# Altium schematic sheet wisp-5-mcu.SchDoc
size A
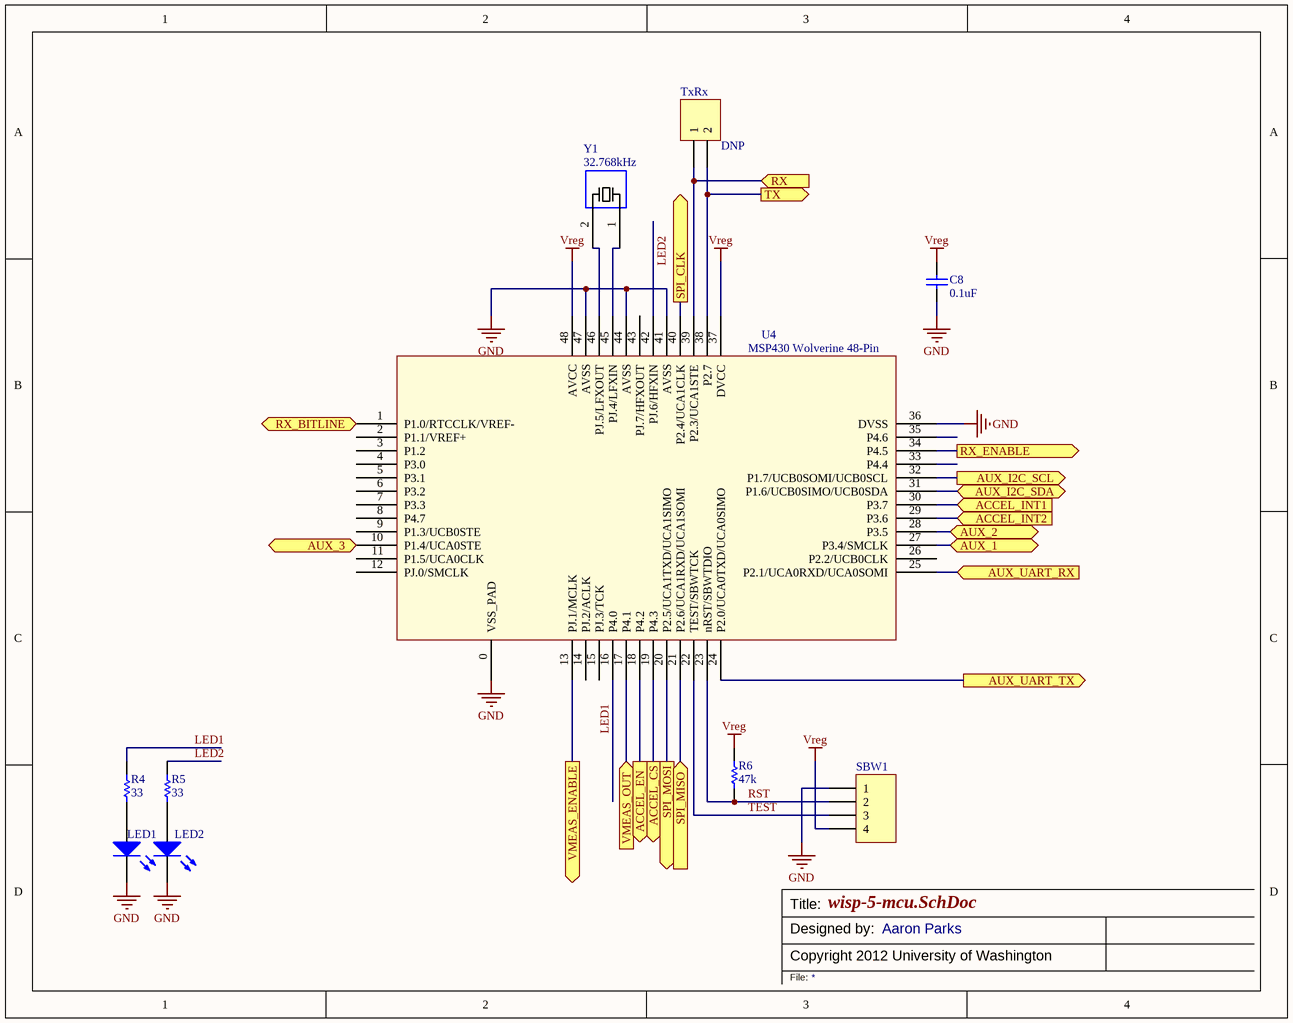
[diagram p0: wisp-5-mcu.SchDoc]

## Parts
C8  value 0.1uF  [0402]  (hidden comment: Cap)
LED1  LED  [Diode - 0603]  (value not drawn)
LED2  LED  [Diode - 0603]  (value not drawn)
R4  value 33  [0402]  (hidden comment: Res)
R5  value 33  [0402]  (hidden comment: Res)
R6  value 47k  [0402]  (hidden comment: Res)
SBW1  4-Pin 0.05" Pitch Female Rt Angle Header  [MHDR1X4]  (value not drawn)
TxRx  MHDR1X2  [MHDR1X2]  (value not drawn)
U4  MSP430 Wolverine 48-Pin  [MSP_QFN48_RGZ_PAD0]
Y1  value 32.768kHz  [XTAL [3.20mm x 1.50mm]]  (hidden comment: XTAL)

## Ports
ACCEL_CS (out), ACCEL_EN (out), ACCEL_INT1 (in), ACCEL_INT2 (in), AUX_1, AUX_2, AUX_3, AUX_I2C_SCL (out), AUX_I2C_SDA (bidir), AUX_UART_RX (in), AUX_UART_TX (out), RX (in), RX_BITLINE (in), RX_ENABLE (out), SPI_CLK (out), SPI_MISO (in), SPI_MOSI (out), TX (out), VMEAS_ENABLE (out), VMEAS_OUT (in)

## Nets
GND: C8.1 LED1.2(K) LED2.2(K) SBW1.1 U4.0(VSS_PAD) U4.36(DVSS) U4.41(AVSS) U4.44(AVSS) U4.47(AVSS)
Vreg: C8.2 R6.2 SBW1.4 U4.37(DVCC) U4.48(AVCC)
ACCEL_CS: U4.19(P4.3) ; port ACCEL_CS
ACCEL_EN: U4.18(P4.2) ; port ACCEL_EN
ACCEL_INT1: U4.30(P3.7) ; port ACCEL_INT1
ACCEL_INT2: U4.29(P3.6) ; port ACCEL_INT2
AUX_1: U4.27(P3.4/SMCLK) ; port AUX_1
AUX_2: U4.28(P3.5) ; port AUX_2
AUX_3: U4.10(P1.4/UCA0STE) ; port AUX_3
AUX_I2C_SCL: U4.32(P1.7/UCB0SOMI/UCB0SCL) ; port AUX_I2C_SCL
AUX_I2C_SDA: U4.31(P1.6/UCB0SIMO/UCB0SDA) ; port AUX_I2C_SDA
AUX_UART_RX: U4.25(P2.1/UCA0RXD/UCA0SOMI) ; port AUX_UART_RX
AUX_UART_TX: U4.24(P2.0/UCA0TXD/UCA0SIMO) ; port AUX_UART_TX
LED1: R4.2 U4.16(P4.0)
LED2: R5.2 U4.42(PJ.6/HFXIN)
RST: R6.1 SBW1.2 U4.23(nRST/SBWTDIO)
RX: TxRx.1 U4.39(P2.3/UCA1STE) ; port RX
RX_BITLINE: U4.1(P1.0/RTCCLK/VREF-) ; port RX_BITLINE
RX_ENABLE: U4.34(P4.5) ; port RX_ENABLE
SPI_CLK: U4.40(P2.4/UCA1CLK) ; port SPI_CLK
SPI_MISO: U4.21(P2.6/UCA1RXD/UCA1SOMI) ; port SPI_MISO
SPI_MOSI: U4.20(P2.5/UCA1TXD/UCA1SIMO) ; port SPI_MOSI
TEST: SBW1.3 U4.22(TEST/SBWTCK)
TX: TxRx.2 U4.38(P2.7) ; port TX
VMEAS_ENABLE: U4.13(PJ.1/MCLK) ; port VMEAS_ENABLE
VMEAS_OUT: U4.17(P4.1) ; port VMEAS_OUT
NetLED1_1: LED1.1(A) R4.1
NetLED2_1: LED2.1(A) R5.1
NetU4_45: U4.45(PJ.4/LFXIN) Y1.1
NetU4_46: U4.46(PJ.5/LFXOUT) Y1.2

Not connected (* = marked no-connect by the designer): U4 2(P1.1/VREF+) 3(P1.2) 4(P3.0) 5(P3.1) 6(P3.2) 7(P3.3) 8(P4.7) 9(P1.3/UCB0STE) 11(P1.5/UCA0CLK) 12(PJ.0/SMCLK) 14(PJ.2/ACLK) 15(PJ.3/TCK) 26(P2.2/UCB0CLK) 33(P4.4) 35(P4.6) 43(PJ.7/HFXOUT)

## Notes on the sheet
- Title:
- Copyright 2012 University of Washington
- Designed by:
- Aaron Parks
- File:

## Library data of the parts
C8 = Cap: Ceramic Capacitor (Surface Mount); Manufacturer: Murata; Manufacturer Part Number: GRM155R71C104KA88D; Digi-Key Part Number: 490-3261-1-ND; Note: *; Rating: *
LED1 LED2 = Diode - LED: Typical RED, GREEN, YELLOW, AMBER GaAs LED; Manufacturer: OSRAM; Manufacturer Part Number: LS L29K-G1J2-1-Z; Digi-Key Part Number: 475-2506-1-ND; Note: *; Value: *; Rating: *
R4 R5 = Res: Chip Resistor (Surface Mount); Manufacturer: Panasonic; Manufacturer Part Number: ERJ-2RKF33R0X; Digi-Key Part Number: P33.0LCT-ND; Rating: *; Note: *
R6 = Res: Chip Resistor (Surface Mount); Manufacturer: Panasonic; Manufacturer Part Number: ERJ-2RKF4702X; Digi-Key Part Number: P47.0KLCT-ND; Rating: *; Note: *
SBW1 = MHDR1X4: Header, 4-Pin; Manufacturer Part Number: 851-43-004-20-001000; Manufacturer: Mill-Max Manufacturing; Digi-Key Part Number: ED90474-ND
TxRx = MHDR1X2: Header, 2-Pin; DNP: DNP
U4 = MSP430FR596X_586X_RGZ: 16-bit FRAM MCU; Manufacturer: Texas Instruments; Manufacturer Part Number: MSP430FR5969IRGZR; Datasheet Link: http://www.ti.com/lit/gpn/msp430fr5969; Digi-Key Part Number: 296-37875-1-ND
Y1 = XTAL 2-pins: Crystal Oscillator - [3.20mm x 1.50mm]; Manufacturer: Epson Toyocom Corporation; Manufacturer Part Number: FC-135 32.7680KA-A3; Digi-Key Part Number: SE2413CT-ND